# EAGLE design 20317 (EAGLE 6.3)
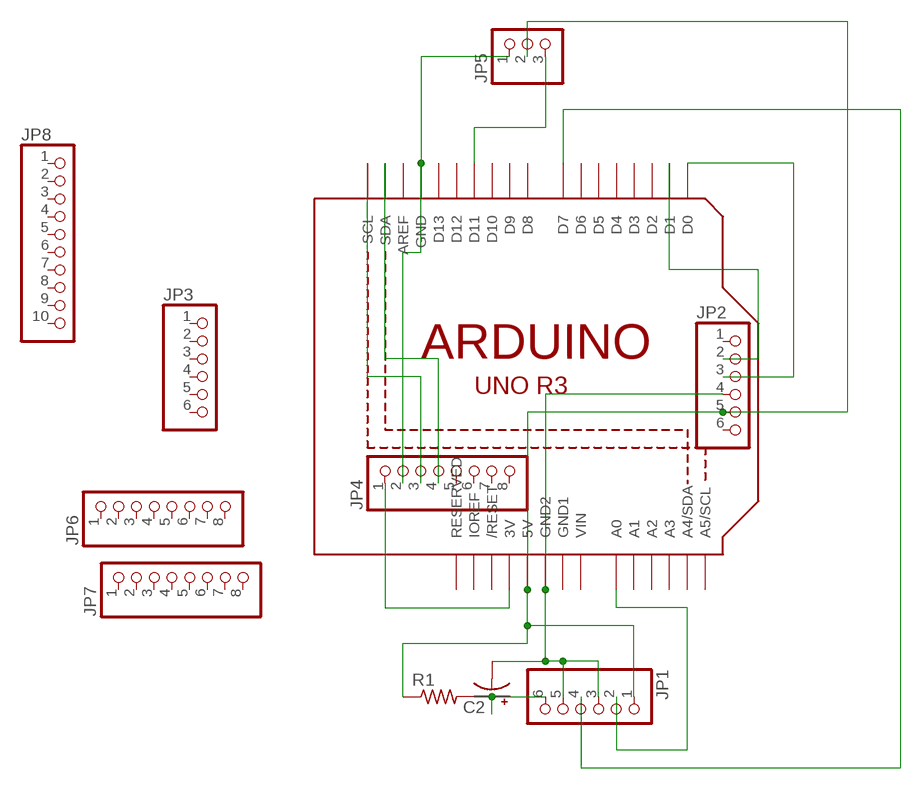
[diagram p0: schematic, sheet 1]

## Parts
C2  CPOL-USE2.5-7  [E2,5-7]
JP1  PINHD-1X6  [1X06]
JP2  PINHD-1X6  [1X06]
JP3  PINHD-1X6  [1X06]
JP4  PINHD-1X8  [1X08]
JP5  PINHD-1X3  [1X03]
JP6  PINHD-1X8  [1X08]
JP7  PINHD-1X8  [1X08]
JP8  PINHD-1X10  [1X10]
R1  R-US_0207/7  [0207/7]
U1  ARDUINOR3-BPLACE  [ARDUINOR3-BPLACE]

## Nets
N$1: JP5.3 U1.D11
N$2: JP4.3 U1.SCL
N$3: JP2.3 U1.D0
N$4: JP2.2 U1.D1
N$5: JP4.2 JP5.1 U1.GND
N$6: JP4.4 U1.SDA
N$8: JP4.1 U1.3V
N$9: JP1.2 U1.A0
N$12: C2.- JP1.3 JP1.5 JP2.4 U1.GND2
N$13: JP1.4 U1.D7
N$14: C2.+ JP1.6 R1.2
N$15: JP1.1 JP2.5 JP5.2 R1.1 U1.5V
Unconnected: JP2.1 JP2.6 JP3.1 JP3.2 JP3.3 JP3.4 JP3.5 JP3.6 JP4.5 JP4.6 JP4.7 JP4.8 JP6.1 JP6.2 JP6.3 JP6.4 JP6.5 JP6.6 JP6.7 JP6.8 JP7.1 JP7.2 JP7.3 JP7.4 JP7.5 JP7.6 JP7.7 JP7.8 JP8.1 JP8.2 JP8.3 JP8.4 JP8.5 JP8.6 JP8.7 JP8.8 JP8.9 JP8.10 U1.A1 U1.A2 U1.A3 U1.A4(A4/SDA) U1.A5(A5/SCL) U1.AREF U1.D2 U1.D3 U1.D4 U1.D5 U1.D6 U1.D8 U1.D9 U1.D10 U1.D12 U1.D13 U1.IOREF U1.RESERVED U1.RESET(/RESET)

## Power pins joined to a net without a drawn wire
GND1: U1.GND1
VIN: U1.VIN

## Library data of the parts
C2 = rcl:CPOL-US: POLARIZED CAPACITOR, American symbol
JP1-JP3 = pinhead:PINHD-1X6: PIN HEADER
JP4 JP6 JP7 = pinhead:PINHD-1X8: PIN HEADER
JP5 = pinhead:PINHD-1X3: PIN HEADER
JP8 = pinhead:PINHD-1X10: PIN HEADER
R1 = rcl:R-US_: RESISTOR, American symbol
U1 = adafruit:ARDUINOR3: This is a new object for the new Arduino R3 - with extra pins that you may want to use (such as IOref, and duplicated A4/A5

## Board
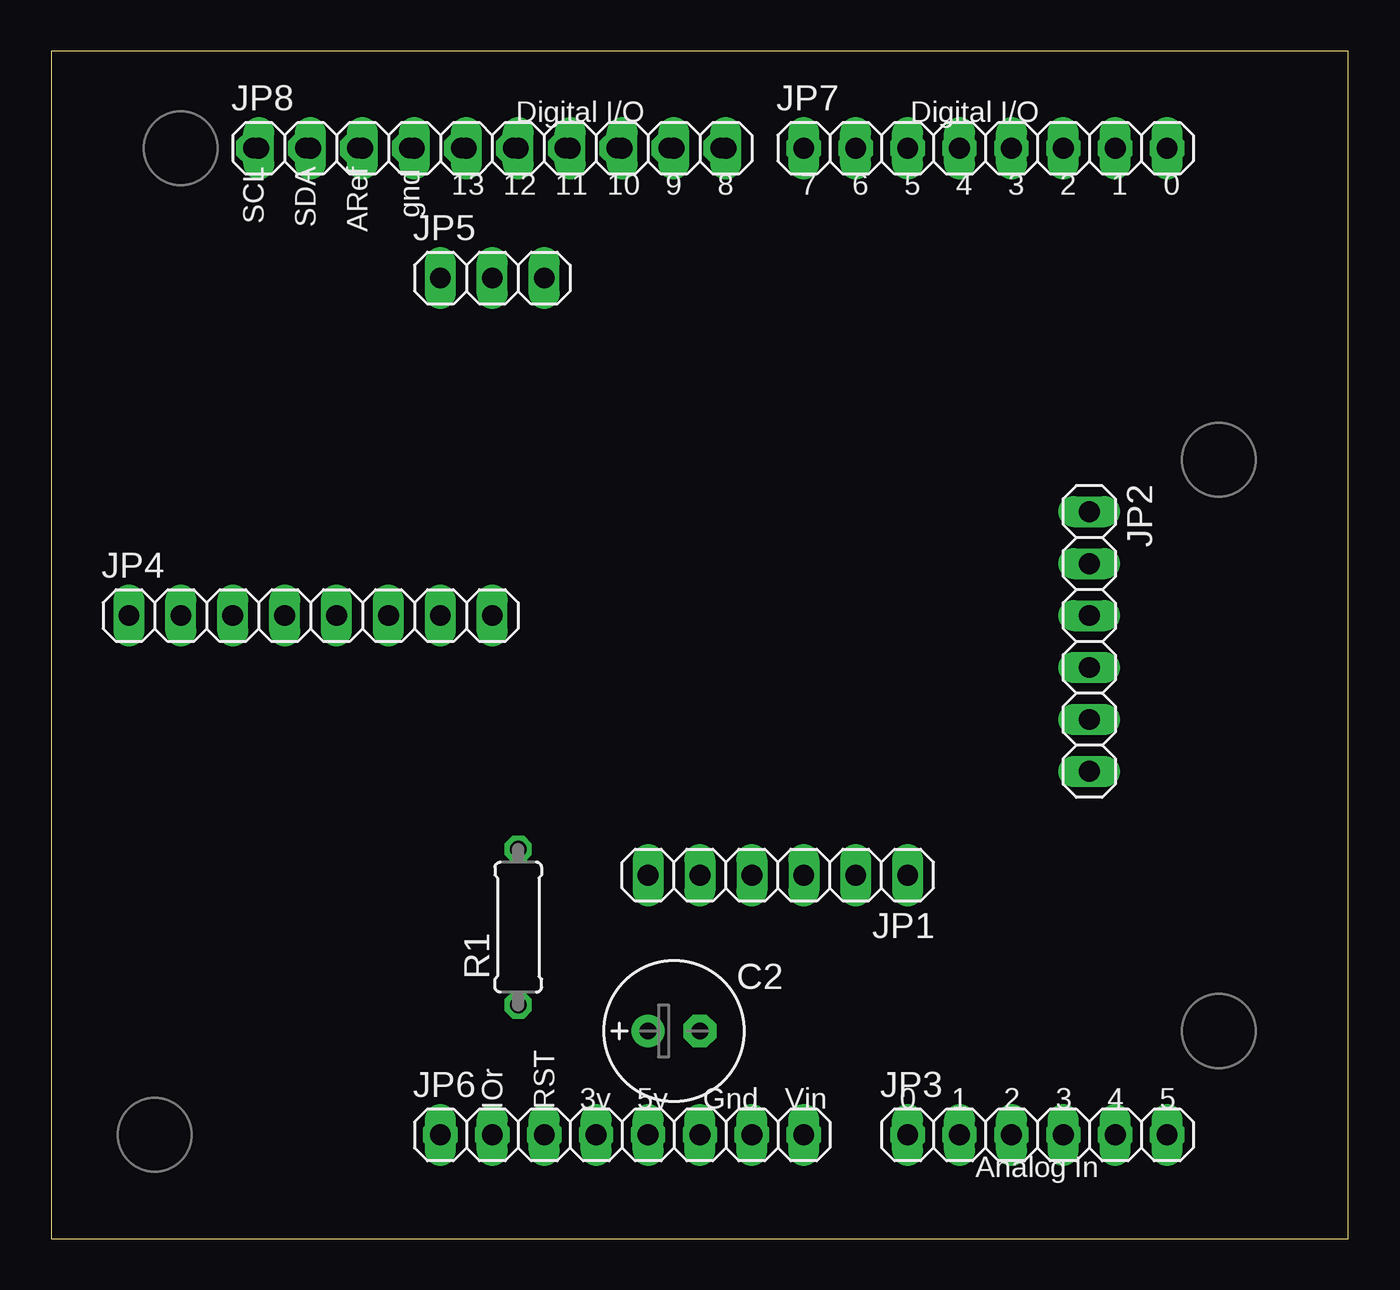
[diagram p1: board, top side]
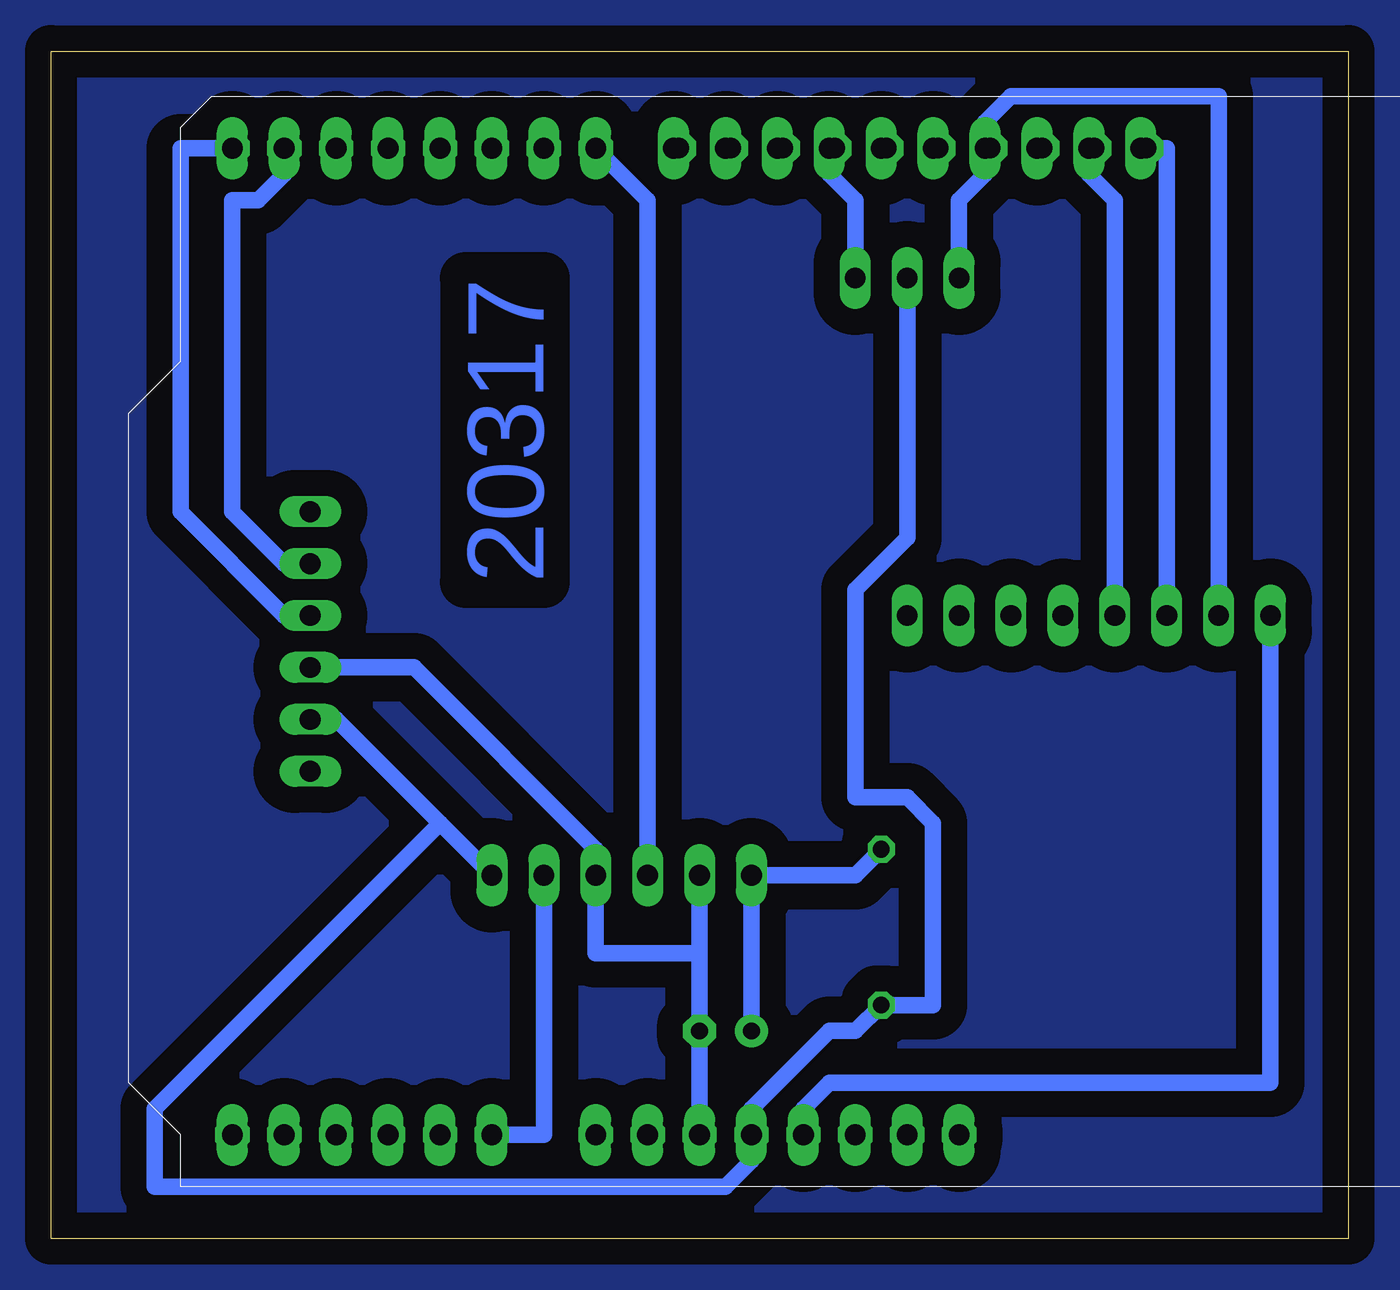
[diagram p2: board, bottom side, seen from below]

Size 63.48 x 58.09 mm. Coordinates in mm from the lower left corner, seen from the top.
Outline: 0,0 63.48,0 63.48,58.09 0,58.09 0,0
Copper layers (1*16): Top 0.035mm / dielectric 1.5mm / Bottom 0.035mm
Design rules "default *": minimum track width 0.8mm, minimum drill 24mil, track to track 0.8mm, track to pad 0.8mm, pad to pad 8mil, via to via 8mil, smd to smd 8mil, copper to edge 40mil, drill to drill 8mil, minimum pad ring 10mil, minimum via ring 8mil, stop-mask expansion 4mil, vias tented up to drill 0mil, thermal gap 10mil

### Footprints (pad centres in the part's own frame; a part is rotated, then mirrored left to right if it is on the bottom)
E2,5-7 = drill 0.813 pad 1.6: + -1.27,0 | drill 0.813 pad 1.6 octagon: - 1.27,0
1X06 = drill 1.016 long: 1 -6.35,0; 2 -3.81,0; 3 -1.27,0; 4 1.27,0; 5 3.81,0; 6 6.35,0
1X08 = drill 1.016 long: 1 -8.89,0; 2 -6.35,0; 3 -3.81,0; 4 -1.27,0; 5 1.27,0; 6 3.81,0; 7 6.35,0; 8 8.89,0
1X03 = drill 1.016 long: 1 -2.54,0; 2 0,0; 3 2.54,0
1X10 = drill 1.016 long: 1 -11.43,0; 2 -8.89,0; 3 -6.35,0; 4 -3.81,0; 5 -1.27,0; 6 1.27,0; 7 3.81,0; 8 6.35,0; 9 8.89,0; 10 11.43,0
0207/7 = drill 0.813 octagon: 1 -3.81,0; 2 3.81,0
ARDUINOR3-BPLACE = drill 1 pad 1.676 octagon: 3V 35.56,2.54; 5V 38.1,2.54; A0 50.8,2.54; A1 53.34,2.54; A2 55.88,2.54; A3 58.42,2.54; A4 60.96,2.54; A5 63.5,2.54; AREF 23.876,50.8; D0 63.5,50.8; D1 60.96,50.8; D2 58.42,50.8; D3 55.88,50.8; D4 53.34,50.8; D5 50.8,50.8; D6 48.26,50.8; D7 45.72,50.8; D8 41.656,50.8; D9 39.116,50.8; D10 36.576,50.8; D11 34.036,50.8; D12 31.496,50.8; D13 28.956,50.8; GND 26.416,50.8; GND1 43.18,2.54; GND2 40.64,2.54; IOREF 30.48,2.54; RESERVED 27.94,2.54; RESET 33.02,2.54; SCL 18.796,50.8; SDA 21.336,50.8; VIN 45.72,2.54

### Placement (x,y rotation side)
C2  30.48,10.16 0 top
JP1  35.56,17.78 180 top
JP2  50.8,29.21 270 top
JP3  48.26,5.08 0 top
JP4  12.7,30.48 0 top
JP5  21.59,46.99 0 top
JP6  27.94,5.08 0 top
JP7  45.72,53.34 0 top
JP8  21.59,53.34 0 top
R1  22.86,15.24 90 top
U1  -8.89,2.54 0 top

### Tracks (layer width: path | path; a pad name or v marks a point on that pad's centre or on a via)
N$1
  Bottom 0.8: JP5.3 24.13,50.8 25.4,52.07 25.4,53.34 U1.D11
N$2
  Bottom 0.8: JP4.3 8.89,53.34 U1.SCL 10.16,53.34
N$3
  Bottom 0.8: JP2.3 52.07,30.48 57.15,35.56 57.15,53.34 U1.D0
N$4
  Bottom 0.8: JP2.2 52.07,33.02 54.61,35.56 54.61,50.8 53.34,50.8 52.07,52.07 U1.D1
N$5
  Bottom 0.8: JP4.2 6.35,55.88 16.51,55.88 17.78,54.61 17.78,53.34 | JP5.1 19.05,50.8 17.78,52.07 17.78,53.34 | 17.78,53.34 U1.GND
N$6
  Bottom 0.8: JP4.4 11.43,50.8 12.7,52.07 12.7,53.34 U1.SDA
N$7
  pour Bottom (isolate 1.27): -2.54,60.96 66.04,60.96 66.04,-2.54 -2.54,-2.54
N$8
  Bottom 0.8: JP4.1 3.81,7.62 25.4,7.62 26.67,6.35 U1.3V
N$9
  Bottom 0.8: JP1.2 39.37,5.08 U1.A0
N$12
  Bottom 0.8: 31.75,13.97 C2.- U1.GND2 | 31.75,13.97 JP1.5 | 31.75,13.97 36.83,13.97 JP1.3 36.83,19.05 45.72,27.94 JP2.4
N$13
  Bottom 0.8: JP1.4 34.29,50.8 U1.D7
N$14
  Bottom 0.8: R1.2 24.13,17.78 JP1.6 C2.+
N$15
  Bottom 0.8: 44.45,20.32 49.53,25.4 JP2.5 | 44.45,20.32 JP1.1 | JP5.2 21.59,34.29 24.13,31.75 24.13,21.59 21.59,21.59 20.32,20.32 20.32,11.43 R1.1 24.13,10.16 25.4,10.16 29.21,6.35 U1.5V 29.21,3.81 30.48,2.54 58.42,2.54 58.42,6.35 44.45,20.32

### Text on the board
Bottom: 20317